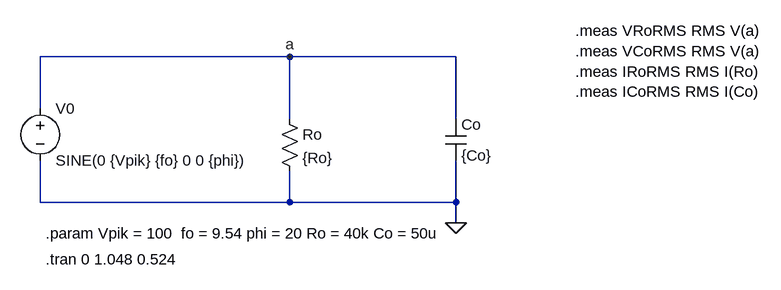
[diagram p0: schematic Lab1_EaD.asc]
Lab1_EaD.asc, the LTspice schematic file:
Version 4
SHEET 1 1160 680
WIRE 416 48 32 48
WIRE 672 48 416 48
WIRE 32 128 32 48
WIRE 416 144 416 48
WIRE 672 144 672 48
WIRE 32 272 32 208
WIRE 416 272 416 224
WIRE 416 272 32 272
WIRE 672 272 672 208
WIRE 672 272 416 272
WIRE 672 304 672 272
FLAG 672 304 0
FLAG 416 48 a
SYMBOL voltage 32 112 R0
WINDOW 123 0 0 Left 0
WINDOW 39 0 0 Left 0
SYMATTR InstName V0
SYMATTR Value SINE(0 {Vpik} {fo} 0 0 {phi})
SYMBOL res 400 128 R0
SYMATTR InstName Ro
SYMATTR Value {Ro}
SYMBOL cap 656 144 R0
SYMATTR InstName Co
SYMATTR Value {Co}
TEXT 40 320 Left 2 !.param Vpik = 100  fo = 9.54 phi = 20 Ro = 40k Co = 50u
TEXT 40 360 Left 2 !.tran 0 1.048 0.524
TEXT 856 8 Left 2 !.meas VRoRMS RMS V(a)\n.meas VCoRMS RMS V(a)\n.meas IRoRMS RMS I(Ro)\n.meas ICoRMS RMS I(Co)

The netlist it stands for:
* Lab1_EaD.asc
V0 a 0 SINE(0 {Vpik} {fo} 0 0 {phi})
Ro a 0 {Ro}
Co a 0 {Co}
.param Vpik = 100  fo = 9.54 phi = 20 Ro = 40k Co = 50u
.tran 0 1.048 0.524
.meas VRoRMS RMS V(a)
.meas VCoRMS RMS V(a)
.meas IRoRMS RMS I(Ro)
.meas ICoRMS RMS I(Co)
.backanno
.end